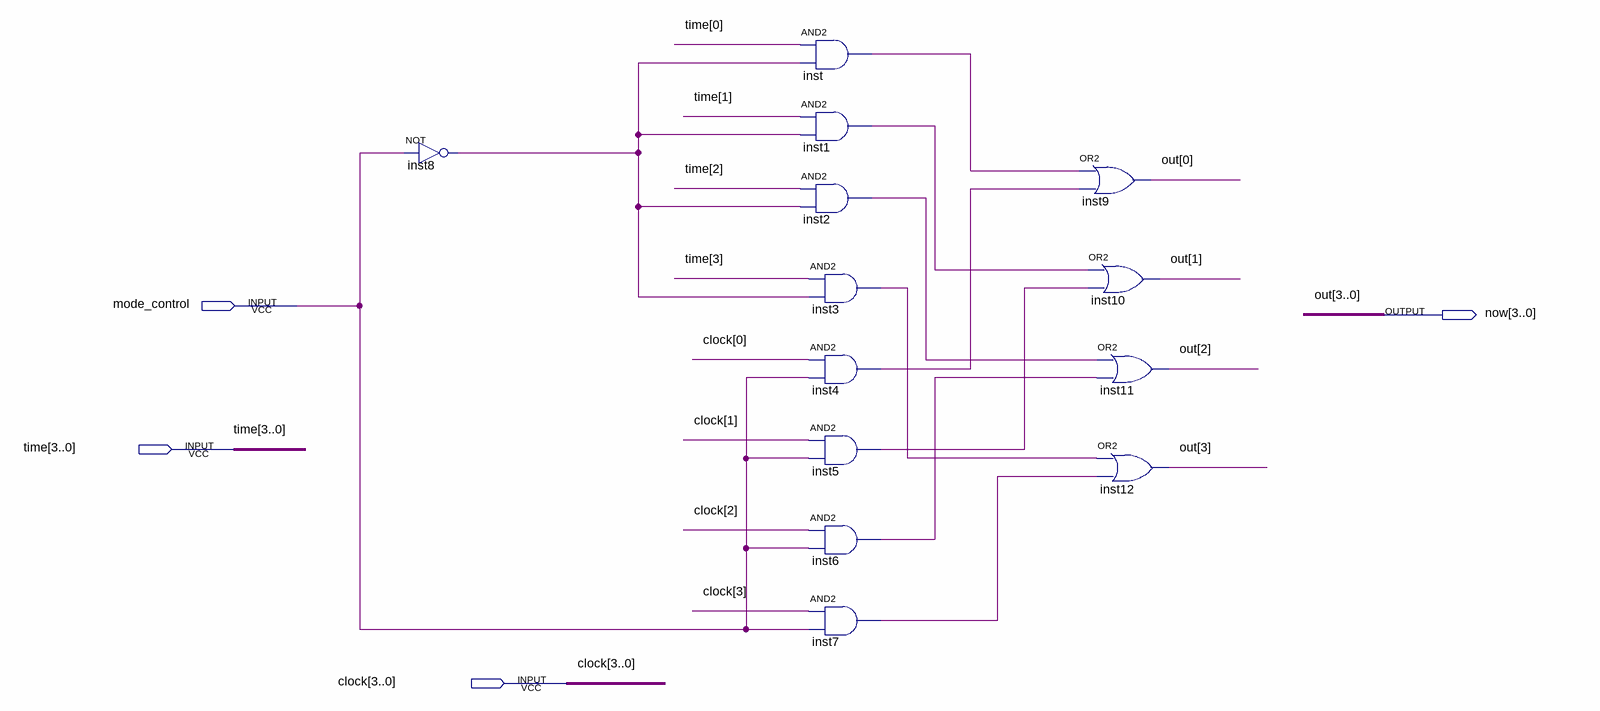
[diagram p0: schematic sheet]
// Quartus schematic mode_select.bdf as structural Verilog: 13 symbols, 4 pins
module mode_select (
  input  mode_control,
  input  [3:0] \time ,
  input  [3:0] clock,
  output [3:0] now
);

  wire inst1_out, inst2_out, inst3_out, inst4_out, inst5_out, inst6_out, inst7_out, inst8_out, inst_out;

  not inst8 (inst8_out, mode_control);
  and inst (inst_out, \time [0], inst8_out);
  and inst1 (inst1_out, \time [1], inst8_out);
  and inst2 (inst2_out, \time [2], inst8_out);
  and inst3 (inst3_out, \time [3], inst8_out);
  and inst4 (inst4_out, clock[0], mode_control);
  and inst5 (inst5_out, clock[1], mode_control);
  and inst6 (inst6_out, clock[2], mode_control);
  and inst7 (inst7_out, clock[3], mode_control);
  or inst9 (now[0], inst_out, inst4_out);
  or inst10 (now[1], inst1_out, inst5_out);
  or inst11 (now[2], inst2_out, inst6_out);
  or inst12 (now[3], inst3_out, inst7_out);

  // Other names for the same wires on the sheet: out[3:0] = now
endmodule
